# Altium schematic sheet hydraulic.SchDoc
size A4
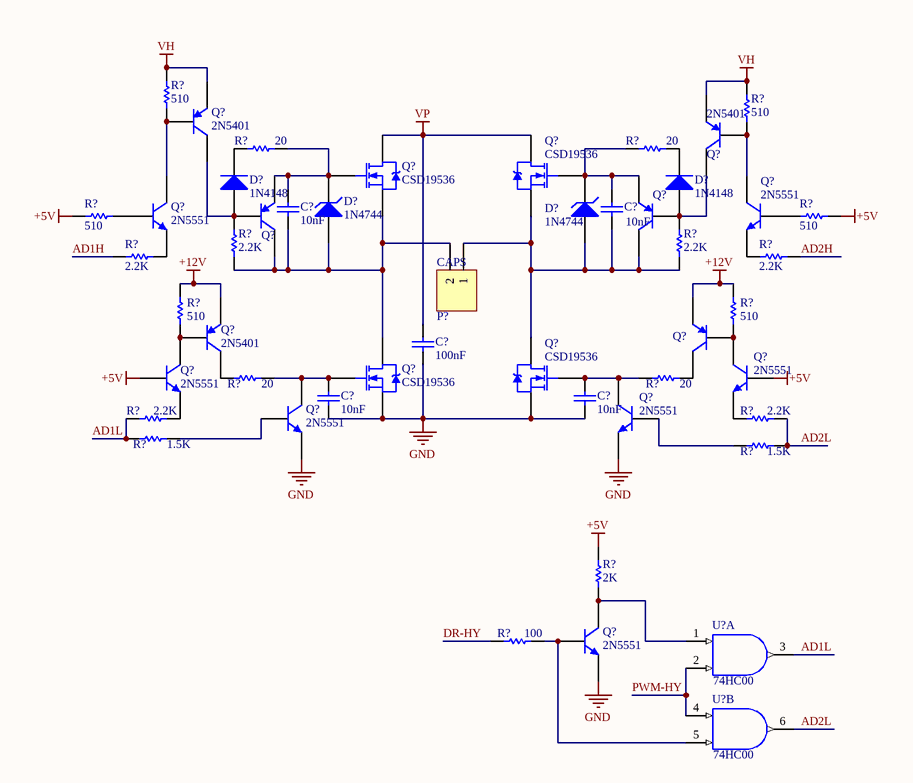
[diagram p0: hydraulic.SchDoc]

## Parts
(Parts that share a designator on the sheet are numbered #1, #2 ... from top to bottom, then left to right.)
C?#1  value 10nF  [R0805]  (hidden comment: Cap)
C?#2  value 10nF  [R0805]  (hidden comment: Cap)
C?#3  value 100nF  [C-5.08]  (hidden comment: Cap)
C?#4  value 10nF  [R0805]  (hidden comment: Cap)
C?#5  value 10nF  [R0805]  (hidden comment: Cap)
D?#1  1N4148  [LL34]
D?#2  1N4148  [LL34]
D?#3  1N4744  [LL34]
D?#4  1N4744  [LL34]
P?  CAPS  [MG7.62-2P]
Q?#1  2N5401  [SOT-23-PNP]
Q?#2  2N5401  [SOT-23-PNP]
Q?#3  CSD19536  [D2PAK]
Q?#4  CSD19536  [D2PAK]
Q?#5  2N5551  [SOT-23-NPN]
Q?#6  2N5401  [SOT-23-PNP]  (value not drawn)
Q?#7  2N5401  [SOT-23-PNP]  (value not drawn)
Q?#8  2N5551  [SOT-23-NPN]
Q?#9  2N5401  [SOT-23-PNP]
Q?#10  2N5401  [SOT-23-PNP]  (value not drawn)
Q?#11  2N5551  [SOT-23-NPN]
Q?#12  CSD19536  [D2PAK]
Q?#13  CSD19536  [D2PAK]
Q?#14  2N5551  [SOT-23-NPN]
Q?#15  2N5551  [SOT-23-NPN]
Q?#16  2N5551  [SOT-23-NPN]
Q?#17  2N5551  [SOT-23-NPN]
R?#1  value 510  [R0805]  (hidden comment: Res1)
R?#2  value 510  [R0805]  (hidden comment: Res1)
R?#3  value 20  [R0805]  (hidden comment: Res1)
R?#4  value 20  [R0805]  (hidden comment: Res1)
R?#5  value 510  [R0805]  (hidden comment: Res1)
R?#6  value 510  [R0805]  (hidden comment: Res1)
R?#7  value 2.2K  [R0805]  (hidden comment: Res1)
R?#8  value 2.2K  [R0805]  (hidden comment: Res1)
R?#9  value 2.2K  [R0805]  (hidden comment: Res1)
R?#10  value 2.2K  [R0805]  (hidden comment: Res1)
R?#11  value 510  [R0805]  (hidden comment: Res1)
R?#12  value 510  [R0805]  (hidden comment: Res1)
R?#13  value 20  [R0805]  (hidden comment: Res1)
R?#14  value 20  [R0805]  (hidden comment: Res1)
R?#15  value 2.2K  [R0805]  (hidden comment: Res1)
R?#16  value 2.2K  [R0805]  (hidden comment: Res1)
R?#17  value 1.5K  [R0805]  (hidden comment: Res1)
R?#18  value 1.5K  [R0805]  (hidden comment: Res1)
R?#19  value 2K  [0603]  (hidden comment: Res1)
R?#20  value 100  [0603]  (hidden comment: Res1)
U?#1  value 74HC00  [751A]  (hidden comment: IC)  (part A of 4)
U?#2  value 74HC00  [751A]  (hidden comment: IC)  (part B of 4)

## Nets
+5V: Q?#11.2(B) Q?#14.2(B) R?#5.2 R?#6.2 R?#19.2
+12V: Q?#9.1(E) Q?#10.1(E) R?#11.1 R?#12.1
DGND: U?#1.7(GND) U?#2.7(GND)
GND: C?#3.2 C?#4.2 C?#5.2 Q?#12.3(S) Q?#13.3(S) Q?#15.1(E) Q?#16.1(E) Q?#17.1(E)
VDD: U?#1.14(VDD) U?#2.14(VDD)
VH: Q?#1.1(E) Q?#2.1(E) R?#1.2 R?#2.2
VP: C?#3.1 Q?#3.2(D) Q?#4.2(D)
AD1H: R?#7.1
AD1L: R?#15.1 R?#17.2 U?#1.3(Y)
AD2H: R?#8.2
AD2L: R?#16.2 R?#18.1 U?#2.6(Y)
DR-HY: R?#20.2
PWM-HY: U?#1.2(B) U?#2.4(A)
NetC?#1_1: C?#1.1 D?#3.2(K) Q?#3.1(G) Q?#6.1(E) R?#3.2
NetC?#1_2: C?#1.2 D?#3.1(A) P?.2 Q?#3.3(S) Q?#6.3(C) Q?#12.2(D) R?#9.1
NetC?#2_1: C?#2.1 D?#4.2(K) Q?#4.1(G) Q?#7.1(E) R?#4.1
NetC?#2_2: C?#2.2 D?#4.1(A) P?.1 Q?#4.3(S) Q?#7.3(C) Q?#13.2(D) R?#10.1
NetC?#4_1: C?#4.1 Q?#12.1(G) Q?#15.3(C) R?#13.2
NetC?#5_1: C?#5.1 Q?#13.1(G) Q?#16.3(C) R?#14.1
NetD?#1_1: D?#1.1(A) Q?#1.3(C) Q?#6.2(B) R?#9.2
NetD?#1_2: D?#1.2(K) R?#3.1
NetD?#2_1: D?#2.1(A) Q?#2.3(C) Q?#7.2(B) R?#10.2
NetD?#2_2: D?#2.2(K) R?#4.2
NetQ?#1_2: Q?#1.2(B) Q?#5.3(C) R?#1.1
NetQ?#2_2: Q?#2.2(B) Q?#8.3(C) R?#2.1
NetQ?#5_1: Q?#5.1(E) R?#7.2
NetQ?#5_2: Q?#5.2(B) R?#6.1
NetQ?#8_1: Q?#8.1(E) R?#8.1
NetQ?#8_2: Q?#8.2(B) R?#5.1
NetQ?#9_2: Q?#9.2(B) Q?#11.3(C) R?#11.2
NetQ?#9_3: Q?#9.3(C) R?#13.1
NetQ?#10_2: Q?#10.2(B) Q?#14.3(C) R?#12.2
NetQ?#10_3: Q?#10.3(C) R?#14.2
NetQ?#11_1: Q?#11.1(E) R?#15.2
NetQ?#14_1: Q?#14.1(E) R?#16.1
NetQ?#15_2: Q?#15.2(B) R?#17.1
NetQ?#16_2: Q?#16.2(B) R?#18.2
NetQ?#17_2: Q?#17.2(B) R?#20.1 U?#2.5(B)
NetQ?#17_3: Q?#17.3(C) R?#19.1 U?#1.1(A)

## Library data of the parts
C?#1-C?#5 = Cap: Capacitor; Published: 8-Jun-2000; LatestRevisionDate: 17-Jul-2002; LatestRevisionNote: Re-released for DXP Platform.; PackageReference: RAD-0.3; Publisher: Altium Limited
D?#1 D?#2 = Diode 1N4148: High Conductance Fast Diode; Published: 8-Jun-2000; LatestRevisionDate: 17-Jul-2002; LatestRevisionNote: Re-released for DXP Platform.; DatasheetDocument: 1997; PackageReference: DO-35; Publisher: Altium Limited; Code_JEDEC: DO-204-AH; ComponentLink1Description: Manufacturer Link; ComponentLink1URL: http://www.fairchildsemi.com/; ComponentLink2Description: Datasheet; ComponentLink2URL: http://www.fairchildsemi.com/ds/1N%2F1N4148.pdf
D?#3 D?#4 = D Zener: Zener Diode; Published: 8-Jun-2000; LatestRevisionDate: 17-Jul-2002; LatestRevisionNote: Re-released for DXP Platform.; PackageReference: DIODE-0.7; Publisher: Altium Limited
P? = Header 2: Header, 2-Pin; LatestRevisionDate: 17-Jul-2002; LatestRevisionNote: Re-released for DXP Platform.; Publisher: Altium Limited
Q?#1 Q?#2 Q?#6 Q?#7 Q?#9 Q?#10 = 2N5401: PNP General Purpose Amplifier; Published: 8-Jun-2000; LatestRevisionDate: 17-Jan-2003; LatestRevisionNote: PCB Footprint 'BCY-W3/D4.7' replaced; DatasheetDocument: 1997; PackageDocument: Sep-1998; PackageReference: TO-92A; Publisher: Altium Limited; ComponentLink1Description: Manufacturer Link; ComponentLink1URL: http://www.fairchildsemi.com/; ComponentLink2Description: Datasheet; ComponentLink2URL: http://www.fairchildsemi.com/ds/2N%2F2N5401.pdf
Q?#3 Q?#4 Q?#12 Q?#13 = IRF644S: HEXFET N-Channel Power MOSFET; Published: 8-Jun-2000; LatestRevisionDate: 17-Jul-2002; LatestRevisionNote: Re-released for DXP Platform.; DatasheetVersion: PD-9.1006; PackageReference: D2PAK; Publisher: Altium Limited; PackageDescription: D2-PAK/TO-263-AB; 3 Leads (1 Cropped); Body 15.5 (inc. leads) x 10.5 mm (LxW max); ComponentLink1Description: Manufacturer Link; ComponentLink1URL: http://www.irf.com/; ComponentLink2Description: Datasheet; ComponentLink2URL: http://www.irf.com/product-info/datasheets/data/irf644s.pdf
Q?#5 Q?#8 Q?#11 Q?#14-Q?#17 = 2N5551: NPN General Purpose Amplifier; Published: 8-Jun-2000; LatestRevisionDate: 17-Jan-2003; LatestRevisionNote: PCB Footprint 'BCY-W3/D4.7' replaced; DatasheetDocument: 1997; PackageDocument: Sep-1998; PackageReference: TO-92A; Publisher: Altium Limited; ComponentLink1Description: Manufacturer Link; ComponentLink1URL: http://www.fairchildsemi.com/; ComponentLink2Description: Datasheet; ComponentLink2URL: http://www.fairchildsemi.com/ds/2N%2F2N5551.pdf
R?#1-R?#20 = Res1: Resistor; Published: 8-Jun-2000; LatestRevisionDate: 17-Jul-2002; LatestRevisionNote: Re-released for DXP Platform.; PackageReference: AXIAL-0.3; Publisher: Altium Limited
U?#1 U?#2 = MC74HC08AD: Quad 2-Input AND Gate; Published: 17-Jul-2002; LatestRevisionDate: 13-Apr-2006; LatestRevisionNote: IPC-7351 Footprint Added.; DatasheetVersion: 1989; PackageVersion: 1991; PackageReference: 751A-02; Publisher: Altium Limited; PackageDescription: 14-Pin Small Outline Integrated Circuit 1.27 mm Pitch; Code_IPC: SOIC127P600-14; ComponentLink1Description: Manufacturer Link; ComponentLink1URL: http://www.onsemi.com/site/products/parametrics/0,4446,247,00.html; ComponentLink2Description: Ibis Model; ComponentLink2URL: http://www.onsemi.com/pub/Collateral/MC54HC08AJ.IBS